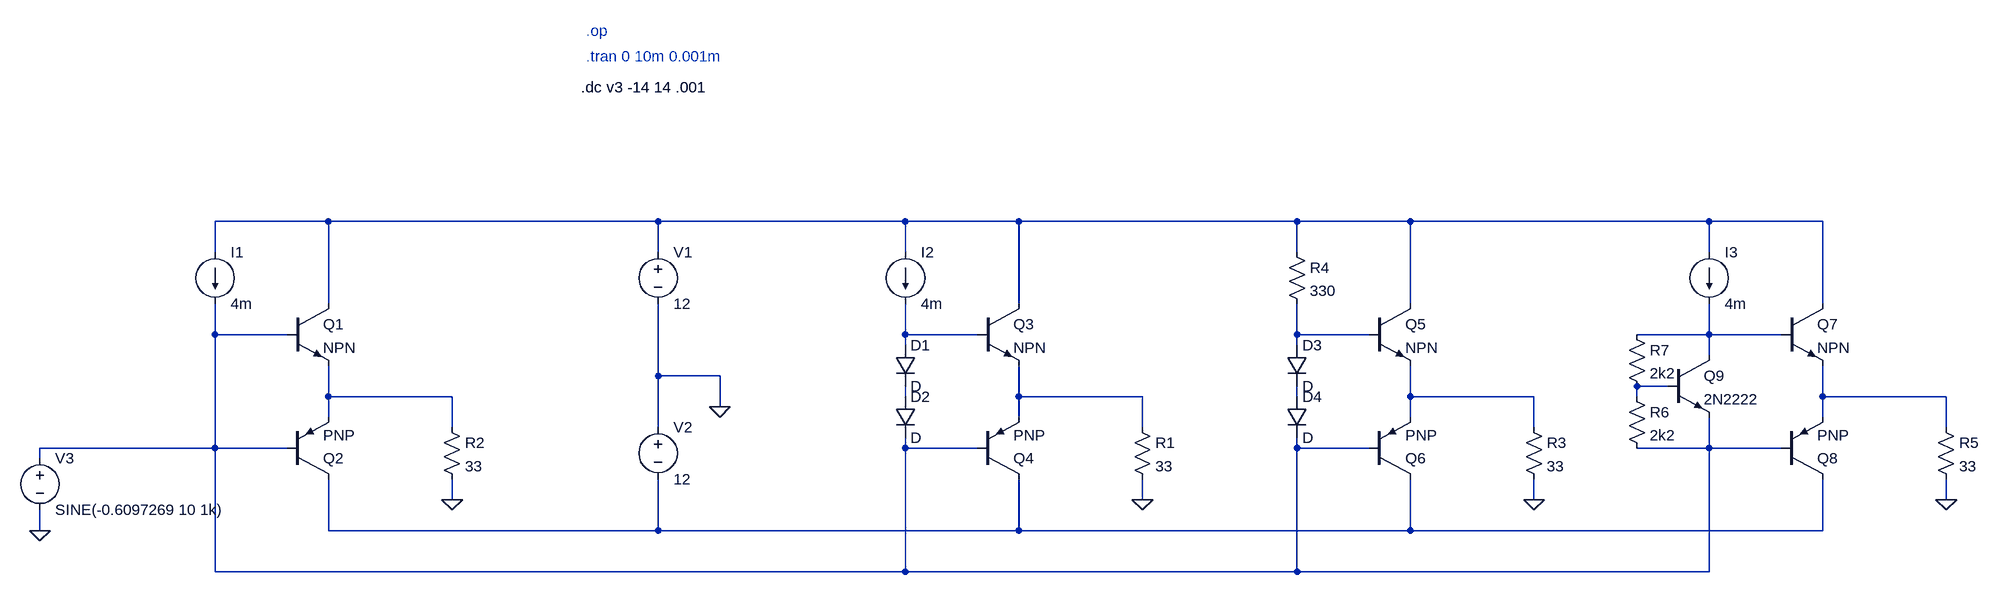
[diagram p0: schematic teoria6.asc]
teoria6.asc, the LTspice schematic file:
Version 4
SHEET 1 2824 680
WIRE 256 -560 80 -560
WIRE 768 -560 256 -560
WIRE 1152 -560 768 -560
WIRE 1328 -560 1152 -560
WIRE 1760 -560 1328 -560
WIRE 1936 -560 1760 -560
WIRE 2400 -560 1936 -560
WIRE 2576 -560 2400 -560
WIRE 80 -512 80 -560
WIRE 768 -512 768 -560
WIRE 1152 -512 1152 -560
WIRE 1760 -512 1760 -560
WIRE 2400 -512 2400 -560
WIRE 256 -432 256 -560
WIRE 1328 -432 1328 -560
WIRE 1936 -432 1936 -560
WIRE 2576 -432 2576 -560
WIRE 80 -384 80 -432
WIRE 192 -384 80 -384
WIRE 1152 -384 1152 -432
WIRE 1264 -384 1152 -384
WIRE 1760 -384 1760 -432
WIRE 1872 -384 1760 -384
WIRE 2400 -384 2400 -432
WIRE 2400 -384 2288 -384
WIRE 2512 -384 2400 -384
WIRE 1152 -368 1152 -384
WIRE 1760 -368 1760 -384
WIRE 2400 -352 2400 -384
WIRE 768 -320 768 -432
WIRE 864 -320 768 -320
WIRE 2336 -304 2288 -304
WIRE 256 -288 256 -336
WIRE 448 -288 256 -288
WIRE 1152 -288 1152 -304
WIRE 1328 -288 1328 -336
WIRE 1520 -288 1328 -288
WIRE 1760 -288 1760 -304
WIRE 1936 -288 1936 -336
WIRE 2128 -288 1936 -288
WIRE 2288 -288 2288 -304
WIRE 2576 -288 2576 -336
WIRE 2768 -288 2576 -288
WIRE 864 -272 864 -320
WIRE 256 -256 256 -288
WIRE 1328 -256 1328 -288
WIRE 1936 -256 1936 -288
WIRE 2576 -256 2576 -288
WIRE 448 -240 448 -288
WIRE 768 -240 768 -320
WIRE 1520 -240 1520 -288
WIRE 2128 -240 2128 -288
WIRE 2768 -240 2768 -288
WIRE 80 -208 80 -384
WIRE 80 -208 -192 -208
WIRE 192 -208 80 -208
WIRE 1152 -208 1152 -224
WIRE 1264 -208 1152 -208
WIRE 1760 -208 1760 -224
WIRE 1872 -208 1760 -208
WIRE 2400 -208 2400 -256
WIRE 2400 -208 2288 -208
WIRE 2512 -208 2400 -208
WIRE -192 -192 -192 -208
WIRE 448 -128 448 -160
WIRE 1520 -128 1520 -160
WIRE 2128 -128 2128 -160
WIRE 2768 -128 2768 -160
WIRE -192 -80 -192 -112
WIRE 256 -80 256 -160
WIRE 768 -80 768 -160
WIRE 768 -80 256 -80
WIRE 1328 -80 1328 -160
WIRE 1328 -80 768 -80
WIRE 1936 -80 1936 -160
WIRE 1936 -80 1328 -80
WIRE 2576 -80 2576 -160
WIRE 2576 -80 1936 -80
WIRE 80 -16 80 -208
WIRE 1152 -16 1152 -208
WIRE 1152 -16 80 -16
WIRE 1760 -16 1760 -208
WIRE 1760 -16 1152 -16
WIRE 2400 -16 2400 -208
WIRE 2400 -16 1760 -16
FLAG 864 -272 0
FLAG 448 -128 0
FLAG -192 -80 0
FLAG 1520 -128 0
FLAG 2128 -128 0
FLAG 2768 -128 0
DATAFLAG 128 -208 ""
DATAFLAG 1200 -208 ""
DATAFLAG 1808 -208 ""
DATAFLAG 2432 -208 ""
DATAFLAG 2656 -288 ""
DATAFLAG 2096 -288 ""
DATAFLAG 1472 -288 ""
DATAFLAG 320 -288 ""
SYMBOL voltage 768 -528 R0
WINDOW 123 0 0 Left 2
WINDOW 39 0 0 Left 2
SYMATTR InstName V1
SYMATTR Value 12
SYMBOL voltage 768 -256 R0
WINDOW 123 0 0 Left 2
WINDOW 39 0 0 Left 2
SYMATTR InstName V2
SYMATTR Value 12
SYMBOL res 432 -256 R0
SYMATTR InstName R2
SYMATTR Value 33
SYMBOL current 80 -512 R0
WINDOW 123 0 0 Left 2
WINDOW 39 0 0 Left 2
SYMATTR InstName I1
SYMATTR Value 4m
SYMBOL npn 192 -432 R0
SYMATTR InstName Q1
SYMBOL pnp 192 -160 M180
SYMATTR InstName Q2
SYMBOL voltage -192 -208 R0
WINDOW 123 24 44 Left 2
WINDOW 39 0 0 Left 0
SYMATTR InstName V3
SYMATTR Value SINE(-0.6097269 10 1k)
SYMBOL res 1504 -256 R0
SYMATTR InstName R1
SYMATTR Value 33
SYMBOL current 1152 -512 R0
WINDOW 123 0 0 Left 2
WINDOW 39 0 0 Left 2
SYMATTR InstName I2
SYMATTR Value 4m
SYMBOL npn 1264 -432 R0
SYMATTR InstName Q3
SYMBOL pnp 1264 -160 M180
SYMATTR InstName Q4
SYMBOL diode 1136 -368 R0
SYMATTR InstName D1
SYMBOL diode 1136 -288 R0
SYMATTR InstName D2
SYMBOL res 2112 -256 R0
SYMATTR InstName R3
SYMATTR Value 33
SYMBOL npn 1872 -432 R0
SYMATTR InstName Q5
SYMBOL pnp 1872 -160 M180
SYMATTR InstName Q6
SYMBOL diode 1744 -368 R0
SYMATTR InstName D3
SYMBOL diode 1744 -288 R0
SYMATTR InstName D4
SYMBOL res 1744 -528 R0
SYMATTR InstName R4
SYMATTR Value 330
SYMBOL res 2752 -256 R0
SYMATTR InstName R5
SYMATTR Value 33
SYMBOL current 2400 -512 R0
WINDOW 123 0 0 Left 2
WINDOW 39 0 0 Left 2
SYMATTR InstName I3
SYMATTR Value 4m
SYMBOL npn 2512 -432 R0
SYMATTR InstName Q7
SYMBOL pnp 2512 -160 M180
SYMATTR InstName Q8
SYMBOL npn 2336 -352 R0
SYMATTR InstName Q9
SYMATTR Value 2N2222
SYMBOL res 2272 -304 R0
SYMATTR InstName R6
SYMATTR Value 2k2
SYMBOL res 2272 -400 R0
SYMATTR InstName R7
SYMATTR Value 2k2
TEXT 656 -856 Left 2 ;.op
TEXT 656 -816 Left 2 ;.tran 0 10m 0.001m
TEXT 648 -768 Left 2 !.dc v3 -14 14 .001

The netlist it stands for:
* teoria6.asc
V1 N001 0 12
V2 0 N013 12
R2 N007 0 33
I1 N001 N002 4m
Q1 N001 N002 N007 0 NPN
Q2 N013 N002 N007 0 PNP
V3 N002 0 SINE(-0.6097269 10 1k)
R1 N009 0 33
I2 N001 N003 4m
Q3 N001 N003 N009 0 NPN
Q4 N013 N002 N009 0 PNP
D1 N003 N008 D
D2 N008 N002 D
R3 N011 0 33
Q5 N001 N004 N011 0 NPN
Q6 N013 N002 N011 0 PNP
D3 N004 N010 D
D4 N010 N002 D
R4 N001 N004 330
R5 N012 0 33
I3 N001 N005 4m
Q7 N001 N005 N012 0 NPN
Q8 N013 N002 N012 0 PNP
Q9 N005 N006 N002 0 2N2222
R6 N006 N002 2k2
R7 N005 N006 2k2
.model D D
.lib standard.dio
.model NPN NPN
.model PNP PNP
.lib standard.bjt
* .op
* .tran 0 10m 0.001m
.dc v3 -14 14 .001
.backanno
.end